# Altium schematic sheet 20.MIPI_LCD_TX1.SchDoc: CM3 IO
size 420 x 297 mm; Page Create Date: March  8, 1995; Page Number: 20; Page Size: A3; Comment: radxa_1010; Page Count: 20; RevCode: 1.36; Doc: MIPI_LCD_TX1; DsnPath: D:\WMS\黄工\[RC119]CM3_IO_V1.36\对外资料\radxa_cm3_io_board_v1360.DSN; SchematicName: CM3_IO V1.36; PageName: 20.MIPI_LCD_TX1; PageSize: A3; TopSchematic: True
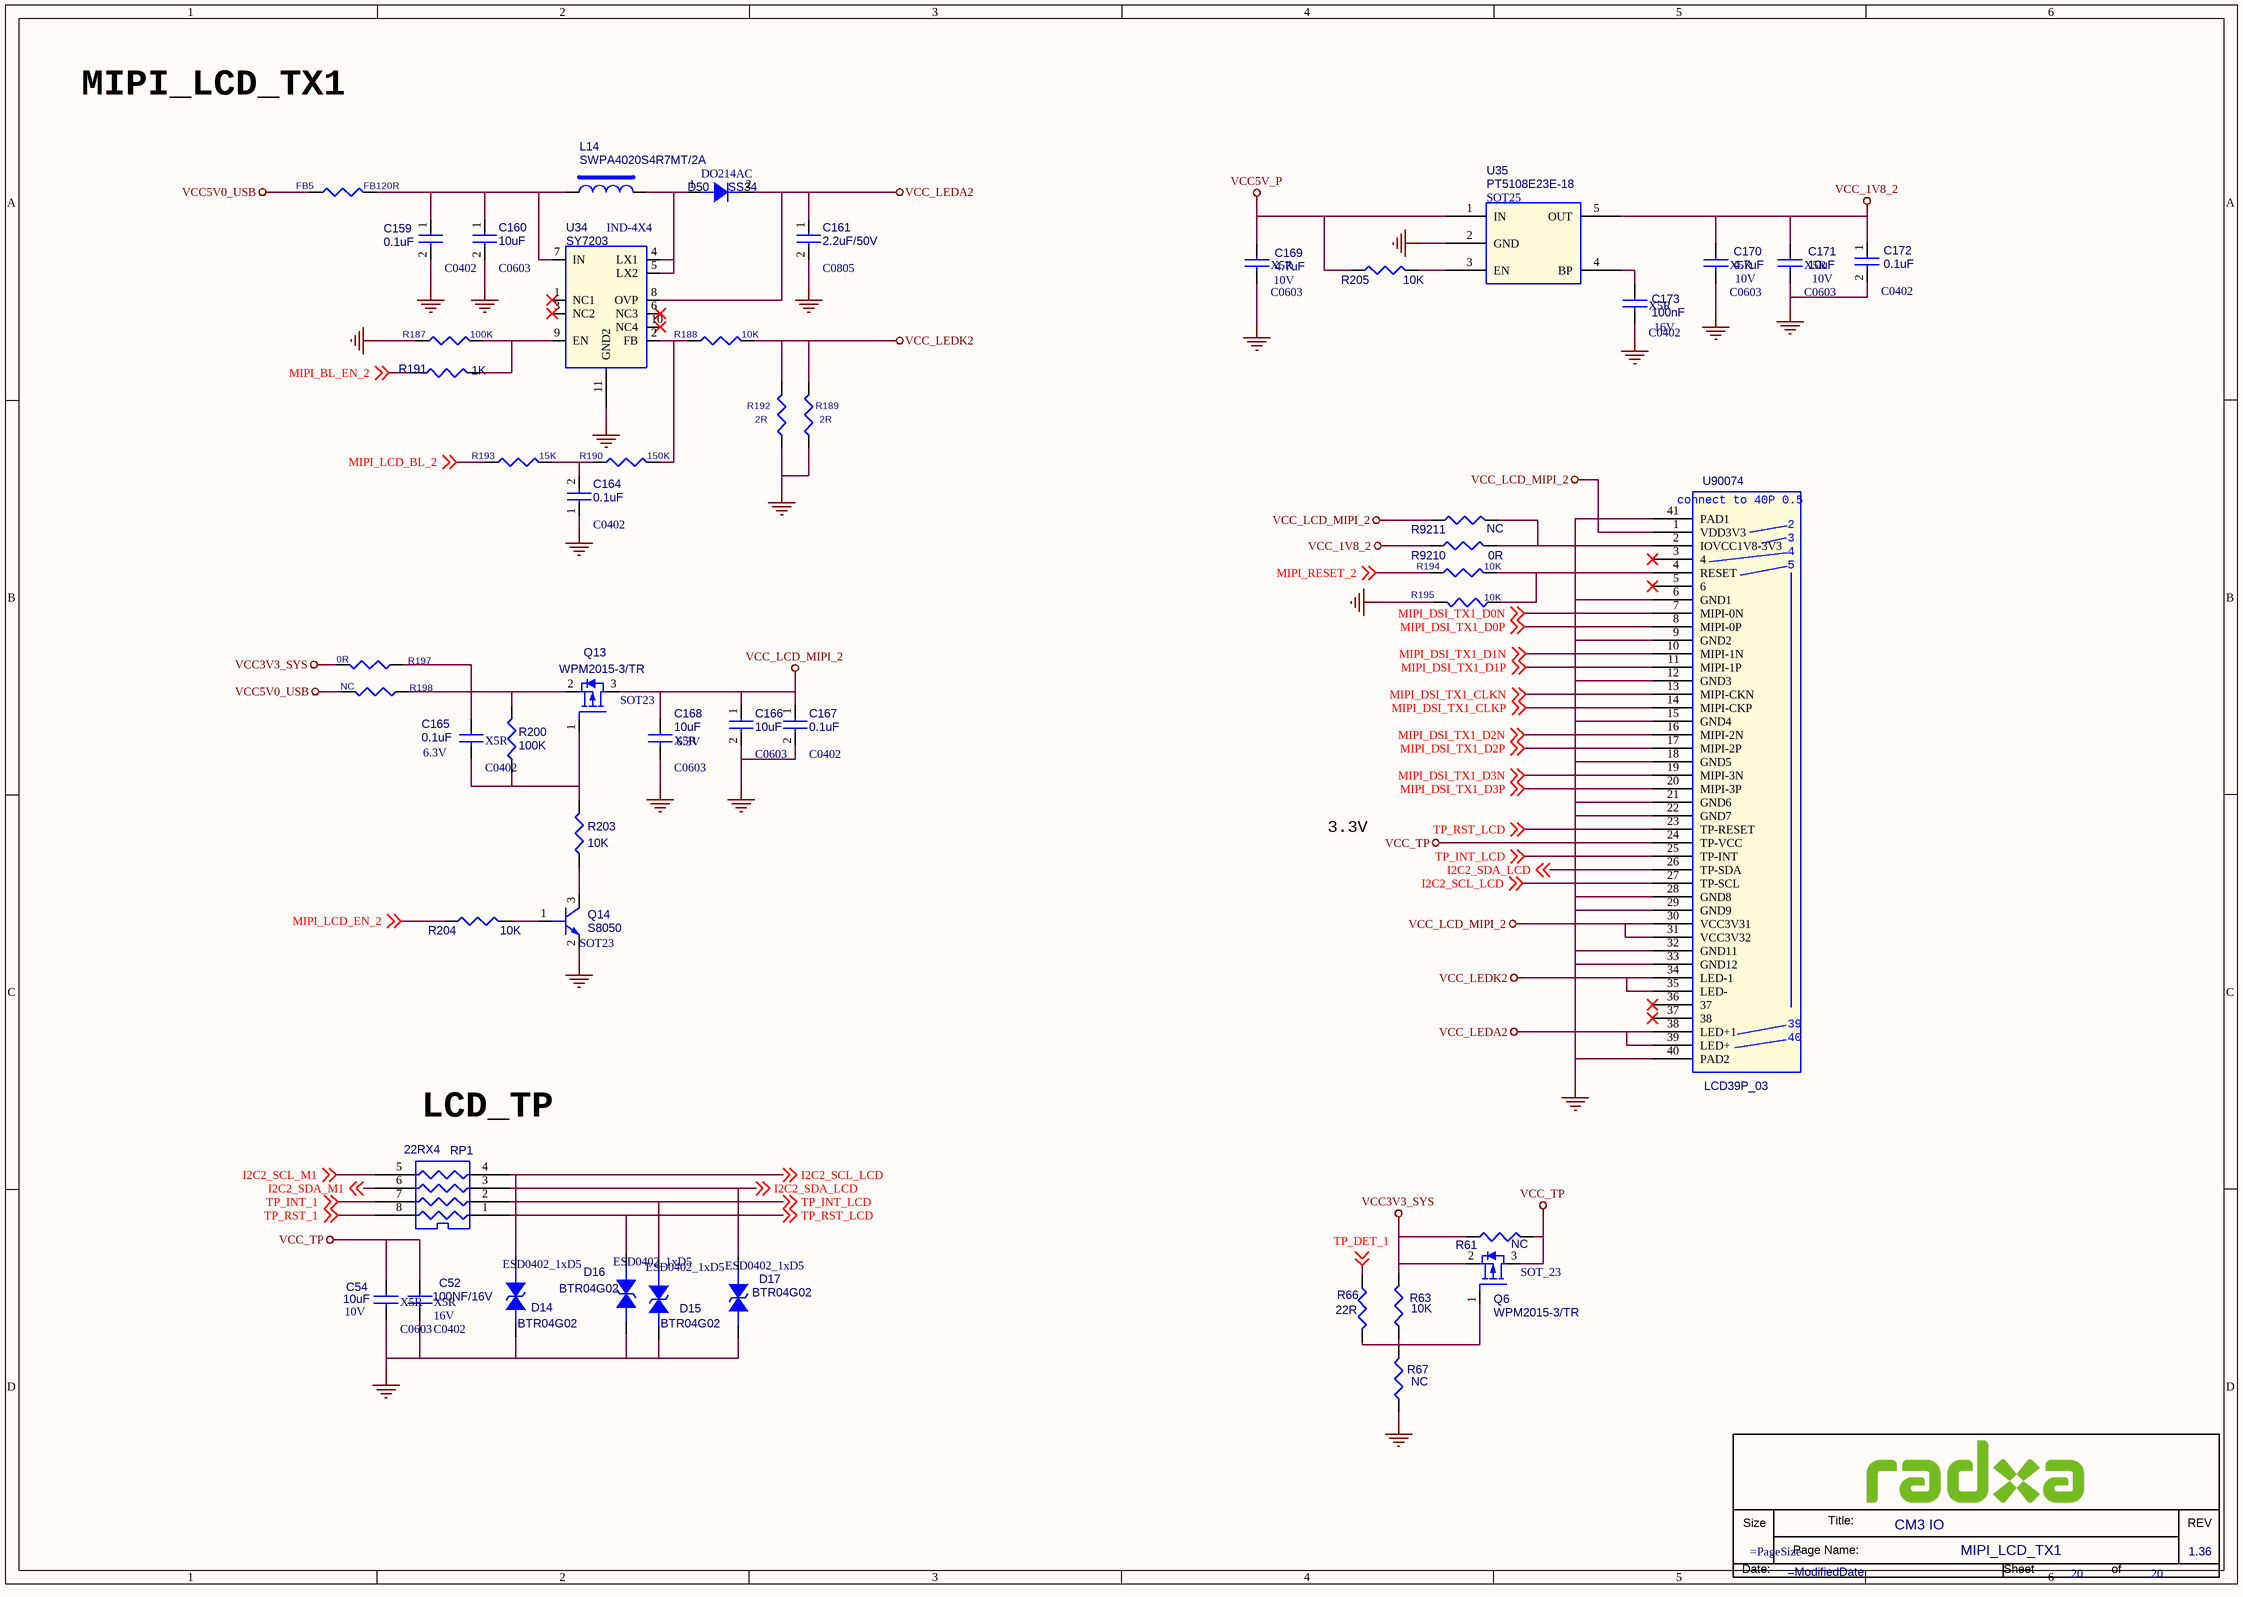
[diagram p0: 20.MIPI_LCD_TX1.SchDoc]

## Parts
*  Doc: MIPI_LCD_TX1  RevCode: 1.36  Title: CM3 IO  Page Number: 20  (hidden comment: radxa_1010)  (graphical)
C52  100NF/16V  Voltage: 16V  Dielectric: X5R  [C0402]
C54  10uF  Voltage: 10V  Dielectric: X5R  [C0603]
C159  0.1uF  [C0402]
C160  10uF  [C0603]
C161  2.2uF/50V  [C0805]
C164  0.1uF  [C0402]
C165  0.1uF  Voltage: 6.3V  Dielectric: X5R  [C0402]
C166  10uF  [C0603]
C167  0.1uF  [C0402]
C168  10uF  Voltage: 6.3V  Dielectric: X5R  [C0603]
C169  4.7uF  Voltage: 10V  Dielectric: X5R  [C0603]
C170  4.7uF  Voltage: 10V  Dielectric: X5R  [C0603]
C171  10uF  Voltage: 10V  Dielectric: X5R  [C0603]
C172  0.1uF  [C0402]
C173  100nF  Voltage: 16V  Dielectric: X5R  [C0402]
D14  BTR04G02  [ESD0402_1xD5]
D15  BTR04G02  [ESD0402_1xD5]
D16  BTR04G02  [ESD0402_1xD5]
D17  BTR04G02  [ESD0402_1xD5]
D50  SS34  [DO214AC]
FB5  FB120R  [R0603]
L14  SWPA4020S4R7MT/2A  [IND-4X4]
Q6  WPM2015-3/TR  PCB Footprint: SOT_23  [SOT23]
Q13  WPM2015-3/TR  [SOT23]
Q14  S8050  [SOT23]
R61  NC  [R0402]
R63  10K  [R0402]
R66  22R  [R0402]
R67  NC  [R0402]
R187  100K  [R0402]
R188  10K  [R0402]
R189  2R  [R0805]
R190  150K  [R0402]
R191  1K  [R0402]
R192  2R  [R0805]
R193  15K  [R0402]
R194  10K  [R0402]
R195  10K  [R0402]
R197  0R  [R0603]
R198  NC  [R0603]
R200  100K  [R0402]
R203  10K  [R0402]
R204  10K  [R0402]
R205  10K  [R0402]
R9210  0R  [R0402]
R9211  NC  [R0402]
RP1  22RX4  [RN8P4RC]
U34  SY7203  [QFN8-2X2]
U35  PT5108E23E-18  [SOT25]
U90074  LCD39P_03  [LCD39PIN-ok]

## Nets
GND: C52.2 C54.2 C159.2 C160.2 C161.2 C164.1 C166.2 C167.2 C168.2 C169.2 C170.2 C171.2 C172.2 C173.2 D14.2 D15.2 D16.2 D17.2 Q14.2(EMITTER) R67.1 R187.1 R189.2 R192.2 R195.2 U34.11(GND2) U35.2(GND) U90074.6(GND1) U90074.9(GND2) U90074.12(GND3) U90074.15(GND4) U90074.18(GND5) U90074.21(GND6) U90074.22(GND7) U90074.28(GND8) U90074.29(GND9) U90074.32(GND11) U90074.33(GND12) U90074.40(PAD2) U90074.41(PAD1)
VCC3V3_SYS: Q6.2(SOURCE) R61.1 R63.2 R197.1
VCC5V0_USB: FB5.1 R198.1
VCC5V_P: C169.1 R205.1 U35.1(IN)
VCC_1V8_2: C170.1 C171.1 C172.1 R9210.1 U35.5(OUT)
VCC_LCD_MIPI_2: C166.1 C167.1 C168.1 Q13.3(DRAIN) R9211.1 U90074.1(VDD3V3) U90074.30(VCC3V31) U90074.31(VCC3V32)
VCC_LEDA2: C161.1 D50.2(K) U34.8(OVP) U90074.38(LED+1) U90074.39(LED+)
VCC_LEDK2: R188.2 R189.1 R192.1 U90074.34(LED-1) U90074.35(LED-)
VCC_TP: C52.1 C54.1 Q6.3(DRAIN) R61.2 U90074.24(TP-VCC)
I2C2_SCL_LCD: D14.1 RP1.4(R4) U90074.27(TP-SCL) ; off-sheet I2C2_SCL_LCD
I2C2_SCL_M1: RP1.5(R4) ; off-sheet I2C2_SCL_M1
I2C2_SDA_LCD: D17.1 RP1.3(R3) U90074.26(TP-SDA) ; off-sheet I2C2_SDA_LCD
I2C2_SDA_M1: RP1.6(R3) ; off-sheet I2C2_SDA_M1
MIPI_BL_EN_2: R191.1 ; off-sheet MIPI_BL_EN_2
MIPI_DSI_TX1_CLKN: U90074.13(MIPI-CKN) ; off-sheet MIPI_DSI_TX1_CLKN
MIPI_DSI_TX1_CLKP: U90074.14(MIPI-CKP) ; off-sheet MIPI_DSI_TX1_CLKP
MIPI_DSI_TX1_D0N: U90074.7(MIPI-0N) ; off-sheet MIPI_DSI_TX1_D0N
MIPI_DSI_TX1_D0P: U90074.8(MIPI-0P) ; off-sheet MIPI_DSI_TX1_D0P
MIPI_DSI_TX1_D1N: U90074.10(MIPI-1N) ; off-sheet MIPI_DSI_TX1_D1N
MIPI_DSI_TX1_D1P: U90074.11(MIPI-1P) ; off-sheet MIPI_DSI_TX1_D1P
MIPI_DSI_TX1_D2N: U90074.16(MIPI-2N) ; off-sheet MIPI_DSI_TX1_D2N
MIPI_DSI_TX1_D2P: U90074.17(MIPI-2P) ; off-sheet MIPI_DSI_TX1_D2P
MIPI_DSI_TX1_D3N: U90074.19(MIPI-3N) ; off-sheet MIPI_DSI_TX1_D3N
MIPI_DSI_TX1_D3P: U90074.20(MIPI-3P) ; off-sheet MIPI_DSI_TX1_D3P
MIPI_LCD_BL_2: R193.1 ; off-sheet MIPI_LCD_BL_2
MIPI_LCD_EN_2: R204.1 ; off-sheet MIPI_LCD_EN_2
MIPI_RESET_2: R194.1 ; off-sheet MIPI_RESET_2
TP_DET_1: R66.1 ; off-sheet TP_DET_1
TP_INT_1: RP1.7(R2) ; off-sheet TP_INT_1
TP_INT_LCD: D15.1 RP1.2(R2) U90074.25(TP-INT) ; off-sheet TP_INT_LCD
TP_RST_1: RP1.8(R1) ; off-sheet TP_RST_1
TP_RST_LCD: D16.1 RP1.1(R1) U90074.23(TP-RESET) ; off-sheet TP_RST_LCD
NetC159_1: C159.1 C160.1 FB5.2 L14.1 U34.7(IN)
NetC164_2: C164.2 R190.1 R193.2
NetC165_1: C165.1 Q13.2(SOURCE) R197.2 R198.2 R200.1
NetC165_2: C165.2 Q13.1(GATE) R200.2 R203.1
NetC173_1: C173.1 U35.4(BP)
NetD50_1: D50.1(A) L14.2 U34.4(LX1) U34.5(LX2)
NetQ6_1: Q6.1(GATE) R63.1 R66.2 R67.2
NetQ14_1: Q14.1(BASE) R204.2
NetQ14_3: Q14.3(COLLECTOR) R203.2
NetR187_2: R187.2 R191.2 U34.9(EN)
NetR188_1: R188.1 R190.2 U34.2(FB)
NetR194_2: R194.2 R195.1 U90074.4(RESET)
NetR205_2: R205.2 U35.3(EN)
NetR9210_2: R9210.2 R9211.2 U90074.2(IOVCC1V8-3V3)

Not connected (* = marked no-connect by the designer): U34 1(NC1)* 3(NC2)* 6(NC3)* 10(NC4)*; U90074 3(4)* 5(6)* 36(37)* 37(38)*

## Notes on the sheet
- MIPI_LCD_TX1
- 3.3V
- (near RP1) LCD_TP
- (in symbol LCD39P_03) connect to 40P 0.5
- (in symbol radxa_1010) Size; Title:; REV; Page Name:; Date:; Sheet; of

## Library data of the parts
C52 = CAP NP_0: cap,100.00nF,+/-10%,16V,X5R,C0402; Part Reference: C52; Manufacturer: TDK; RK PN: C1005X5R1C104K050BA; Priority: A; Tolerance: 10%; PCB Footprint: C0402; Value: 100NF/16V; Part Type: C0402; Manufacturer PN: C1005X5R1C104K050BA; Created by: JJJ
C54 = CAP NP_0: cap,10.00uF,+/-10%,10V,X5R,C0603; Part Reference: C54; Manufacturer PN: C1608X5R1A106K080AC; Manufacturer: TDK; Tolerance: 10%; Priority: A; PCB Footprint: C0603; Value: 10uF; Created by: JJJ; Part Type: C0603; RK PN: C1608X5R1A106K080AC
C159 = CAP NP: CAP,MLCC,100nF,+/-10%,X7R,6.3V,SMD0402; Part Reference: C159; PCB Footprint: C0402; Value: 0.1uF
C160 = CAP NP: Part Reference: C160; PCB Footprint: C0603; Value: 10uF
C161 = CAP NP: RoHS CHIP CAP 1uF +10/-10% 25V X5R; Part Reference: C161; PCB Footprint: C0805; Value: 2.2uF/50V
C164 = CAP NP: RoHS CHIP CAP 0.1uF +10/-10% X7R; Part Reference: C164; PCB Footprint: C0402; Value: 0.1uF
C165 = CAP NP_0: cap,100.00nF,+/-10%,6.3V,X5R,C0402; Part Reference: C165; Manufacturer: TDK; RK PN: C1005X5R0J104K050BA; Priority: A; Tolerance: 10%; PCB Footprint: C0402; Value: 0.1uF; Part Type: C0402; Manufacturer PN: C1005X5R0J104K050BA; Created by: JJJ
C166 = CAP NP: CAP,MLCC,4.7uF,+/-10%,X5R,6.3V,SMD0603; Part Reference: C166; PCB Footprint: C0603; Value: 10uF
C167 = CAP NP: CAP,MLCC,100nF,+/-10%,X7R,6.3V,SMD0402; Part Reference: C167; PCB Footprint: C0402; Value: 0.1uF
C168 = CAP NP_0: cap,4.70uF,+/-10%,6.3V,X5R,C0603; Part Reference: C168; Manufacturer: TDK; RK PN: C1608X5R0J475K080AB; Priority: A; Tolerance: 10%; PCB Footprint: C0603; Value: 10uF; Part Type: C0603; Manufacturer PN: C1608X5R0J475K080AB; Created by: JJJ
C169 = CAP NP_0: cap,4.70uF,+/-10%,10V,X5R,C0603; Part Reference: C169; Manufacturer: TDK; RK PN: C1608X5R1A475K080AC; Priority: A; Tolerance: 10%; PCB Footprint: C0603; Value: 4.7uF; Part Type: C0603; Manufacturer PN: C1608X5R1A475K080AC; Created by: JJJ
C170 = CAP NP_0: cap,4.70uF,+/-10%,10V,X5R,C0603; Part Reference: C170; Manufacturer PN: C1608X5R1A475K080AC; Manufacturer: TDK; Tolerance: 10%; Priority: A; PCB Footprint: C0603; Value: 4.7uF; Created by: JJJ; Part Type: C0603; RK PN: C1608X5R1A475K080AC
C171 = CAP NP_0: cap,10.00uF,+/-10%,10V,X5R,C0805; Part Reference: C171; Manufacturer PN: C2012X5R1A106K125AB; Manufacturer: TDK; Tolerance: 10%; Priority: A; PCB Footprint: C0603; Value: 10uF; Created by: JJJ; Part Type: C0805; RK PN: C2012X5R1A106K125AB
C172 = CAP NP: CAP,MLCC,100nF,+/-10%,X7R,6.3V,SMD0402; Part Reference: C172; PCB Footprint: C0402; Value: 0.1uF
C173 = CAP NP_0: cap,100.00nF,+/-10%,16V,X5R,C0402; Part Reference: C173; Manufacturer: TDK; RK PN: C1005X5R1C104K050BA; Priority: A; Tolerance: 10%; PCB Footprint: C0402; Value: 100nF; Part Type: C0402; Manufacturer PN: C1005X5R1C104K050BA; Created by: JJJ
D14 = DIODE BI_DIR TRIG_0: 1-Line, Bi-directional, Transient Voltage Suppressors.17.5pF.; Part Reference: D14; Manufacturer PN: ESD5451N; Manufacturer: WillSemi(韦尔半导体); OPTION: DNP; Priority: A; PCB Footprint: ESD0402_1xD5; Value: BTR04G02; Created by: JJJ; Part Type: ESD_TVS; RK PN: ESD5451N
D15 = DIODE BI_DIR TRIG_0: 1-Line, Bi-directional, Transient Voltage Suppressors.17.5pF.; Part Reference: D15; Manufacturer: WillSemi(韦尔半导体); RK PN: ESD5451N; Priority: A; OPTION: DNP; PCB Footprint: ESD0402_1xD5; Value: BTR04G02; Part Type: ESD_TVS; Manufacturer PN: ESD5451N; Created by: JJJ
D16 = DIODE BI_DIR TRIG_0: 1-Line, Bi-directional, Transient Voltage Suppressors.17.5pF.; Part Reference: D16; Manufacturer: WillSemi(韦尔半导体); RK PN: ESD5451N; Priority: A; OPTION: DNP; PCB Footprint: ESD0402_1xD5; Value: BTR04G02; Part Type: ESD_TVS; Manufacturer PN: ESD5451N; Created by: JJJ
D17 = DIODE BI_DIR TRIG_0: 1-Line, Bi-directional, Transient Voltage Suppressors.17.5pF.; Part Reference: D17; Manufacturer: WillSemi(韦尔半导体); RK PN: ESD5451N; Priority: A; OPTION: DNP; PCB Footprint: ESD0402_1xD5; Value: BTR04G02; Part Type: ESD_TVS; Manufacturer PN: ESD5451N; Created by: JJJ
D50 = DIODE: Part Reference: D50; PCB Footprint: DO214AC; Value: SS34
FB5 = RES 1B: ROHS CHIP RES 4.7K 1/16W 5%; Part Reference: FB5; Value: FB120R; PCB Footprint: R0603
L14 = INDUCTORS OF FERRITE: Part Reference: L14; PCB Footprint: IND-4X4; Value: SWPA4020S4R7MT/2A
Q6 = MOSFET P: PMOS,WPM2015-3/TR,SOT_23,Id=2.4A,Vds=20V; Part Reference: Q6; Manufacturer: WillSemi(韦尔半导体); ROOM: CHG; Priority: A; Id_max: 2.4A; Vgs: ±8V; VDS: 20V; Vgsth: 0.62V; Pd: 0.5W; option: DNP; Value: WPM2015-3/TR; RK PN: WPM2015-3/TR; Part Type: PMOS; Manufacturer PN: WPM2015-3/TR; Created by: JJJ
Q13 = MOSFET P: PMOS,WPM2015-3/TR,SOT23,Id=2.4A,Vds=20V; Part Reference: Q13; Manufacturer: WillSemi(韦尔半导体); Pd: 0.5W; Vgsth: 0.62V; VDS: 20V; Vgs: ±8V; Id: 2.4A; Priority: A; PCB Footprint: SOT23; Value: WPM2015-3/TR; Created by: JJJ; Manufacturer PN: WPM2015-3/TR; Part Type: PMOS; RK PN: WPM2015-3/TR
Q14 = NPN: S8050 SOT23; Part Reference: Q14; Manufacturer: 长电; Manufacturer PN: S8050_SOT23; Priority: A; Ic: 0.5A; Vceo: 25V; Pc: 0.3W; PCB Footprint: SOT23; Value: S8050; RK PN: S8050; Part Type: NPN; Created by: JJJ
R61 = RESISTOR_0: 通用厚膜电阻,0R,+/-5%,R0402,1/16W.; Part Reference: R61; Manufacturer PN: RC0402JR-070RL; Manufacturer: YAGEO; Wattage: 1/16W; Tolerance: 5%; Priority: A; Value: NC; Created by: YTL; Part Type: 通用厚膜电阻; RK PN: RC0402JR-070RL; PCB Footprint: R0402
R63 = RESISTOR_0: 通用厚膜电阻,10K,+/-5%,R0402,1/16W.; Part Reference: R63; Manufacturer PN: RC0402JR-0710KL; Manufacturer: YAGEO; Wattage: 1/16W; Tolerance: 5%; Priority: A; Value: 10K; Created by: YTL; Part Type: 通用厚膜电阻; RK PN: RC0402JR-0710KL; PCB Footprint: R0402
R66 = RESISTOR_0: 通用厚膜电阻,100K,+/-5%,R0402,1/16W.; Part Reference: R66; Manufacturer: YAGEO; RK PN: RC0402JR-07100KL; Priority: A; Tolerance: 5%; Wattage: 1/16W; Value: 22R; Part Type: 通用厚膜电阻; Manufacturer PN: RC0402JR-07100KL; Created by: YTL; PCB Footprint: R0402
R67 = RESISTOR_0: 通用厚膜电阻,10K,+/-5%,R0402,1/16W.; Part Reference: R67; Manufacturer: YAGEO; RK PN: RC0402JR-0710KL; Priority: A; Tolerance: 5%; Wattage: 1/16W; Value: NC; Part Type: 通用厚膜电阻; Manufacturer PN: RC0402JR-0710KL; Created by: YTL; PCB Footprint: R0402
R187 = RES 1B: ROHS CHIP RES 4.7K 1/16W 5%; Part Reference: R187; Value: 100K; PCB Footprint: R0402
R188 = RES 1B: ROHS CHIP RES 82K 1/16W 5%; Part Reference: R188; Value: 10K; PCB Footprint: R0402
R189 = RES 1B: ROHS CHIP RES 4.7R 1/4W 5%; Part Reference: R189; Value: 2R; PCB Footprint: R0805
R190 = RES 1B: ROHS CHIP RES 4.7K 1/16W 5%; Part Reference: R190; Value: 150K; PCB Footprint: R0402
R191 = RESISTOR_0: 通用厚膜电阻,10K,+/-5%,R0402,1/16W.; Part Reference: R191; Manufacturer PN: RC0402JR-0710KL; Manufacturer: YAGEO; Wattage: 1/16W; Tolerance: 5%; Priority: A; Value: 1K; Created by: YTL; Part Type: 通用厚膜电阻; RK PN: RC0402JR-0710KL; PCB Footprint: R0402
R192 = RES 1B: ROHS CHIP RES 4.7R 1/4W 5%; Part Reference: R192; Value: 2R; PCB Footprint: R0805
R193 = RES 1B: ROHS CHIP RES 4.7K 1/16W 5%; Part Reference: R193; Value: 15K; PCB Footprint: R0402
R194 = RES 1B: ROHS CHIP RES 4.7K 1/16W 5%; Part Reference: R194; Value: 10K; PCB Footprint: R0402
R195 = RES 1B: ROHS CHIP RES 4.7K 1/16W 5%; Part Reference: R195; Value: 10K; PCB Footprint: R0402
R197 = RES 1B: ROHS CHIP RES 4.7R 1/4W 5%; Part Reference: R197; Value: 0R; PCB Footprint: R0603
R198 = RES 1B: ROHS CHIP RES 4.7R 1/4W 5%; Part Reference: R198; Value: NC; PCB Footprint: R0603
R200 = RESISTOR_0: 通用厚膜电阻,100K,+/-5%,R0402,1/16W.; Part Reference: R200; Manufacturer PN: RC0402JR-07100KL; Manufacturer: YAGEO; Wattage: 1/16W; Tolerance: 5%; Priority: A; Value: 100K; Created by: YTL; Part Type: 通用厚膜电阻; RK PN: RC0402JR-07100KL; PCB Footprint: R0402
R203 = RESISTOR_0: 通用厚膜电阻,10K,+/-5%,R0402,1/16W.; Part Reference: R203; Manufacturer PN: RC0402JR-0710KL; Manufacturer: YAGEO; Wattage: 1/16W; Tolerance: 5%; Priority: A; Value: 10K; Created by: YTL; Part Type: 通用厚膜电阻; RK PN: RC0402JR-0710KL; PCB Footprint: R0402
R204 = RESISTOR_0: 通用厚膜电阻,10K,+/-5%,R0402,1/16W.; Part Reference: R204; Manufacturer PN: RC0402JR-0710KL; Manufacturer: YAGEO; Wattage: 1/16W; Tolerance: 5%; Priority: A; Value: 10K; Created by: YTL; Part Type: 通用厚膜电阻; RK PN: RC0402JR-0710KL; PCB Footprint: R0402
R205 = RESISTOR_0: 通用厚膜电阻,10K,+/-5%,R0402,1/16W.; Part Reference: R205; Manufacturer: YAGEO; RK PN: RC0402JR-0710KL; Priority: A; Tolerance: 5%; Wattage: 1/16W; Value: 10K; Part Type: 通用厚膜电阻; Manufacturer PN: RC0402JR-0710KL; Created by: YTL; PCB Footprint: R0402
R9210 = RESISTOR_0: 通用厚膜电阻,10K,+/-5%,R0402,1/16W.; Part Reference: R9210; Manufacturer PN: RC0402JR-0710KL; Manufacturer: YAGEO; Wattage: 1/16W; Tolerance: 5%; Priority: A; Value: 0R; Created by: YTL; Part Type: 通用厚膜电阻; RK PN: RC0402JR-0710KL; PCB Footprint: R0402
R9211 = RESISTOR_0: 通用厚膜电阻,10K,+/-5%,R0402,1/16W.; Part Reference: R9211; Manufacturer PN: RC0402JR-0710KL; Manufacturer: YAGEO; Wattage: 1/16W; Tolerance: 5%; Priority: A; Value: NC; Created by: YTL; Part Type: 通用厚膜电阻; RK PN: RC0402JR-0710KL; PCB Footprint: R0402
RP1 = R-PACK4: Part Reference: RP1; Value: 22RX4; PCB Footprint: RN8P4RC
U34 = MP3202-QFN8_1: Part Reference: U34; PCB Footprint: DFN10P_3X3; Value: SY7203
U35 = LDO_PT5108: 500mA, Low Dropout, Low Noise Ultra-Fast Without Bypass Capacitor CMOS LDO Regulator; Part Reference: U35; Manufacturer PN: RT9013-30GB; Manufacturer: Richtek（立錡）; Priority: A; RK PN: RT9013-30B; Option: /CE75B30M; PCB Footprint: SOT25; Value: PT5108E23E-18; Created by: JJJ; Part Type: LDO
U90074 = LCD39P_03: Part Reference: U90074; Value: LCD39P_03; PCB Footprint: LCD39PIN-ok
* = radxa_1010: Page Create Date: March  8, 1995; Page Size: =PageSize; Page Count: 20; Page Modify Date: =ModifiedDate